# EAGLE design untitled (EAGLE 7.7.0)
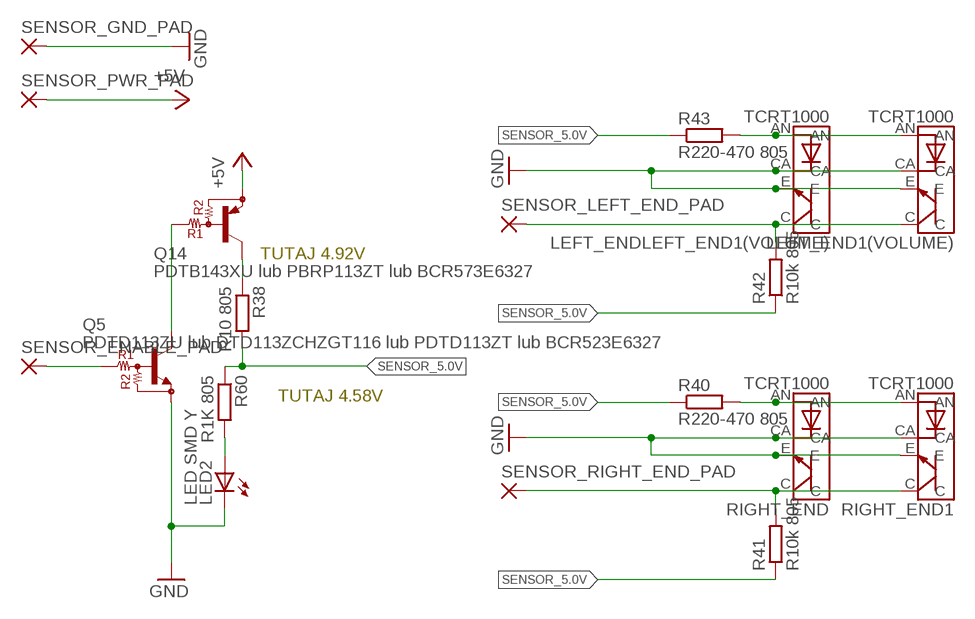
[diagram p0: schematic, sheet 1]

## Parts
LED2  LED SMD Y  LEDCHIP-LED0805  [CHIP-LED0805]
LEFT_END1(VOLUME)  TCRT1000  [TCRT1000]
LEFT_ENDLEFT_END1(VOLUME)  TCRT1000  [TCRT1000]
Q5  PDTD113ZU lub DTD113ZCHZGT116 lub PDTD113ZT lub BCR523E6327  PDTD113ZU  [SOT-23]
Q14  PDTB143XU lub PBRP113ZT lub BCR573E6327  PDTB143XU  [SOT-23]
R38  R10 805  R-EU_R0805  [R0805]
R40  R220-470 805  R-EU_M0805  [M0805]
R41  R10k 805  R-EU_M0805  [M0805]
R42  R10k 805  R-EU_M0805  [M0805]
R43  R220-470 805  R-EU_M0805  [M0805]
R60  R1K 805  R-EU_R0805  [R0805]
RIGHT_END  TCRT1000  [TCRT1000]
RIGHT_END1  TCRT1000  [TCRT1000]
SENSOR_ENABLE_PAD  SMD2  [SMD1,27-2,54]
SENSOR_GND_PAD  SMD2  [SMD1,27-2,54]
SENSOR_LEFT_END_PAD  SMD2  [SMD1,27-2,54]
SENSOR_PWR_PAD  SMD2  [SMD1,27-2,54]
SENSOR_RIGHT_END_PAD  SMD2  [SMD1,27-2,54]

## Nets
+5V: Q14.2(E) SENSOR_PWR_PAD.1(P)
END_SENSOR_ENABLE: Q5.1(B) SENSOR_ENABLE_PAD.1(P)
GND: LED2.C LEFT_END1(VOLUME).CA LEFT_END1(VOLUME).E LEFT_ENDLEFT_END1(VOLUME).CA LEFT_ENDLEFT_END1(VOLUME).E Q5.2(E) RIGHT_END1.CA RIGHT_END1.E RIGHT_END.CA RIGHT_END.E SENSOR_GND_PAD.1(P)
N$7: Q5.3(C) Q14.1(B)
N$10: R40.2 RIGHT_END1.AN RIGHT_END.AN
N$11: Q14.3(C) R38.1
N$13: LEFT_END1(VOLUME).AN LEFT_ENDLEFT_END1(VOLUME).AN R43.2
N$14: LEFT_END1(VOLUME).C LEFT_ENDLEFT_END1(VOLUME).C R42.2 SENSOR_LEFT_END_PAD.1(P)
N$15: R41.2 RIGHT_END1.C RIGHT_END.C SENSOR_RIGHT_END_PAD.1(P)
N$31: LED2.A R60.2
SENSOR_5.0V: R38.2 R40.1 R41.1 R42.1 R43.1 R60.1

## Notes on the sheet
- TUTAJ 4.92V
- TUTAJ 4.58V

## Library data of the parts
LED2 = adafruit:LED: LED OSRAM: - CHIPLED LG R971, LG N971, LY N971, LG Q971, LY Q971, LO R971, LY R971 LH N974, LH R974 LS Q976, LO Q976, LY Q976 LO Q996 - Hyper CHIPLED LW Q18S LB Q993, LB Q99A, LB R99A - SideLED LS A670, LO A670, LY A670, LG A670, LP A670 LB A673, LV A673, LT A673, LW A673 LH A674 LY A675 LS A676, LA A676, LO A676, LY A676, LW A676 LS A679, LY A679, LG A679 - Hyper Micro SIDELED® LS Y876, LA Y876, LO Y876, LY Y876 LT Y87S - SmartLED LW L88C, LW L88S LB L89C, LB L89S, LG L890 LS L89K, LO L89K, LY L89K LS L896, LA L896, LO L896, LY L896 - TOPLED LS T670, LO T670, LY T670, LG T670, LP T670 LSG T670, LSP T670, LSY T670, LOP T670, LYG T670 LG T671, LOG T671, LSG T671 LB T673, LV T673, LT T673, LW T673 LH T674 LS T676, LA T676, LO T676, LY T676, LB T676, LH T676, LSB T676, LW T676 LB T67C, LV T67C, LT T67C, LS T67K, LO T67K, LY T67K, LW E67C LS E67B, LA E67B, LO E67B, LY E67B, LB E67C, LV E67C, LT E67C LW T67C LS T679, LY T679, LG T679 LS T770, LO T770, LY T770, LG T770, LP T770 LB T773, LV T773, LT T773, LW T773 LH T774 LS E675, LA E675, LY E675, LS T675 LS T776, LA T776, LO T776, LY T776, LB T776 LHGB T686 LT T68C, LB T68C - Hyper Mini TOPLED® LB M676 - Mini TOPLED Santana® LG M470 LS M47K, LO M47K, LY M47K Source: http://www.osram.convergy.de/
LEFT_END1(VOLUME) LEFT_ENDLEFT_END1(VOLUME) RIGHT_END RIGHT_END1 = tcrt1010:TCRT1000
Q5 = pre-bias-transistor:PDTD: Pre biase NPN transistor NPN Resistor-Equipped Transistor (RET) family in a very small SOT323 (SC-70) Surface-Mounted Device (SMD) plastic package. VCC = 50V Ic (max) = 500 mA; R1: 1 kOhm; R2: 10 kOhm
Q14 = pre-bias-transistor:PDTB: PNP Resistor-Equipped Transistor (RET) family in a very small SOT323 (SC-70) Surface-Mounted Device (SMD) plastic package. VCC = -50 IC (max) = -500mA; R1: 4.7 kOhm; R2: 10 kOhm
R38 R40-R43 R60 = rcl:R-EU_: RESISTOR, European symbol
SENSOR_ENABLE_PAD SENSOR_GND_PAD SENSOR_LEFT_END_PAD SENSOR_PWR_PAD SENSOR_RIGHT_END_PAD = wirepad:SMD2: SMD PAD

## Net classes
1 VCC: width 0.6 mm, clearance 0.6 mm

## Board
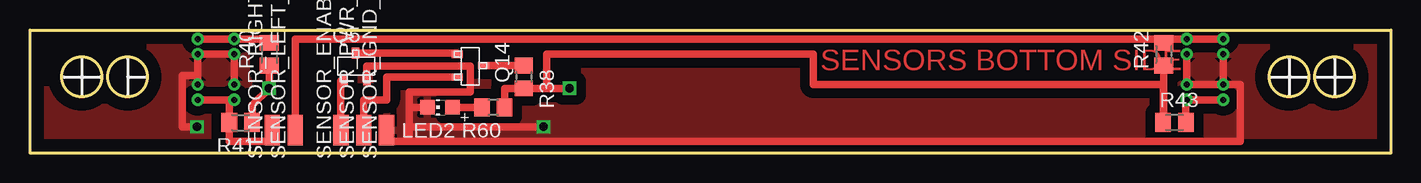
[diagram p1: board, top side]
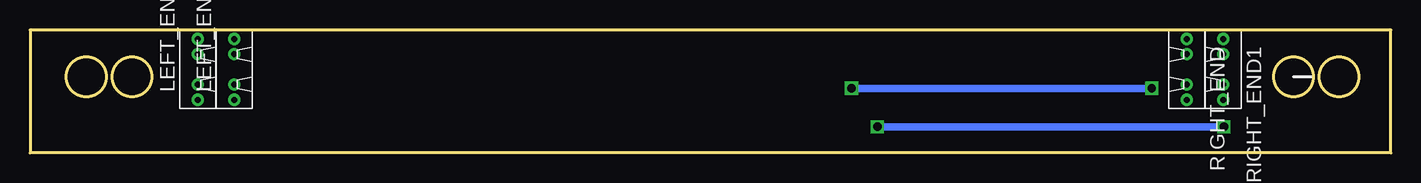
[diagram p2: board, bottom side, seen from below]

Size 113.41 x 10.28 mm. Coordinates in mm from the lower left corner, seen from the top.
Outline: 0,0 0,10.28 113.41,10.28 113.41,0 0,0
Outline: circle at 8.13,6.35 radius 1.65
Outline: circle at 104.91,6.35 radius 1.65
Outline: circle at 4.32,6.35 radius 1.65
Outline: circle at 108.72,6.35 radius 1.65
Copper layers (1*16): Top 0.035mm / dielectric 1.5mm / Bottom 0.035mm
Design rules "default": minimum track width 10mil, minimum drill 24mil, track to track 8mil, track to pad 8mil, pad to pad 8mil, via to via 8mil, smd to smd 8mil, copper to edge 40mil, drill to drill 8mil, minimum pad ring 10mil, minimum via ring 8mil, stop-mask expansion 4mil, vias tented up to drill 0mil, thermal gap 10mil

### Footprints (pad centres in the part's own frame; a part is rotated, then mirrored left to right if it is on the bottom)
CHIP-LED0805 = smd 1.2 x 1.2: A 0,-1.05; C 0,1.05
TCRT1000 = drill 0.5 pad 1.016: AN -2.54,0; C 2.54,0; CA -1.27,0; E 1.27,0
SOT-23 = smd 0.6 x 0.9: 1 -1,-1.1; 2 0.9,-1.1; 3 -0.05,1.1
R0805 = smd 1.3 x 1.5: 1 -0.95,0; 2 0.95,0
M0805 = smd 1.3 x 1.6: 1 -0.95,0; 2 0.95,0
SMD1,27-2,54 = smd 1.27 x 2.54: 1 0,0

### Placement (x,y rotation side)
LED2  34.16,3.81 90 top
LEFT_END1(VOLUME)  99.44,6.98 90 bottom
LEFT_ENDLEFT_END1(VOLUME)  96.39,6.98 90 bottom
Q5  27.18,7.24 0 top
Q14  36.7,7.24 270 top
R38  41.15,6.35 270 top
R40  19.93,8.26 90 top
R41  17.55,2.54 180 top
R42  94.49,8.26 90 top
R43  95.38,2.54 0 top
R60  38.61,3.81 180 top
RIGHT_END  17.02,6.98 270 bottom
RIGHT_END1  13.97,6.98 270 bottom
SENSOR_ENABLE_PAD  25.91,1.91 0 top
SENSOR_GND_PAD  29.72,1.91 0 top
SENSOR_LEFT_END_PAD  22.1,1.91 0 top
SENSOR_PWR_PAD  27.81,1.91 0 top
SENSOR_RIGHT_END_PAD  20.19,1.91 0 top

### Tracks (layer width: path | path; a pad name or v marks a point on that pad's centre or on a via)
+5V
  Top 0.61: Q14.2 29.72,6.34 29.72,4.45 27.81,4.45 SENSOR_PWR_PAD.1
END_SENSOR_ENABLE
  Top 0.61: Q5.1 25.91,6.01 SENSOR_ENABLE_PAD.1
GND  (via drill 0.7)
  Top 0.61: LEFT_END1(VOLUME).CA LEFT_ENDLEFT_END1(VOLUME).CA LEFT_ENDLEFT_END1(VOLUME).E | LEFT_END1(VOLUME).CA LEFT_END1(VOLUME).E | 13.97,6.48 RIGHT_END1.E | 13.97,6.48 RIGHT_END1.CA RIGHT_END.CA RIGHT_END.E | 31.62,3.81 31.62,5.08 36.7,5.08 36.7,7.26 28.08,7.26 Q5.2 | LED2.C 31.62,3.81 | LEFT_END1(VOLUME).CA 100.84,5.72 100.84,0.97 31.62,0.97 | 31.62,0.97 29.85,0.97 arc-90 SENSOR_GND_PAD.1 | 31.62,2.54 31.62,3.81 | 31.62,2.54 31.62,0.97 | v13.92,2.18 12.7,2.18 12.7,6.48 13.97,6.48 | v42.8,2.18 31.62,2.18 31.62,2.54
  Bottom 0.61: v42.8,2.18 v13.92,2.18
  pour Top (isolate 0.813): -1.02,-1.64 114.53,-2.06 114.83,13.94 -0.59,13.79
N$7
  Top 0.61: 35.6,8.21 Q14.1 35.6,8.34 Q5.3
N$10
  Top 0.61: RIGHT_END1.AN RIGHT_END.AN 19.61,9.52 R40.2
N$11
  Top 0.61: Q14.3 R38.1
N$13
  Top 0.61: LEFT_END1(VOLUME).AN LEFT_ENDLEFT_END1(VOLUME).AN 96.33,4.45 R43.2
N$14
  Top 0.61: LEFT_END1(VOLUME).C LEFT_ENDLEFT_END1(VOLUME).C 94.81,9.52 R42.2 94.49,9.52 22.1,9.52 SENSOR_LEFT_END_PAD.1
N$15
  Top 0.61: RIGHT_END1.C RIGHT_END.C 16.6,4.45 R41.2 16.6,0.97 20.19,0.97 SENSOR_RIGHT_END_PAD.1
N$31
  Top 0.61: LED2.A R60.2
SENSOR_5.0V  (via drill 0.7)
  Top 0.61: 94.49,5.72 94.49,2.54 R43.1 94.43,5.4 | 94.49,5.72 R42.1 | R38.2 43.05,5.4 43.05,8.26 65.28,8.26 65.28,5.72 94.49,5.72 | R60.1 39.56,5.4 R38.2 | R41.1 18.5,4.02 v19.93,5.4 R40.1 | R38.2 v44.96,5.4
  Bottom 0.61: v44.96,5.4 v19.93,5.4

### Text on the board
Top: SENSORS BOTTOM SIDE